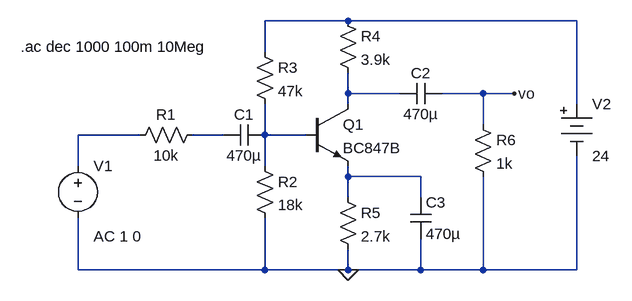
[diagram p0: schematic Actividad amplificador de frec..asc]
Actividad amplificador de frec..asc, the LTspice schematic file:
Version 4
SHEET 1 888 680
WIRE 384 -80 256 -80
WIRE 736 -80 384 -80
WIRE 256 -32 256 -80
WIRE 384 32 384 0
WIRE 464 32 384 32
WIRE 592 32 528 32
WIRE 640 32 592 32
WIRE 384 48 384 32
WIRE 736 48 736 -80
WIRE 592 80 592 32
WIRE 64 96 -32 96
WIRE 192 96 144 96
WIRE 256 96 256 48
WIRE 320 96 256 96
WIRE -32 144 -32 96
WIRE 256 144 256 96
WIRE 384 160 384 144
WIRE 496 160 384 160
WIRE 384 192 384 160
WIRE 496 192 496 160
WIRE -32 304 -32 224
WIRE 256 304 256 224
WIRE 256 304 -32 304
WIRE 384 304 384 272
WIRE 384 304 256 304
WIRE 496 304 496 256
WIRE 496 304 384 304
WIRE 592 304 592 160
WIRE 592 304 496 304
WIRE 736 304 736 128
WIRE 736 304 592 304
FLAG 384 304 0
FLAG 640 32 vo
SYMBOL voltage -32 128 R0
WINDOW 123 24 124 Left 2
WINDOW 39 0 0 Left 0
SYMATTR InstName V1
SYMATTR Value ""
SYMATTR Value2 AC 1 0
SYMBOL res 160 80 R90
WINDOW 0 0 56 VBottom 2
WINDOW 3 32 56 VTop 2
SYMATTR InstName R1
SYMATTR Value 10k
SYMBOL res 240 128 R0
SYMATTR InstName R2
SYMATTR Value 18k
SYMBOL res 240 -48 R0
SYMATTR InstName R3
SYMATTR Value 47k
SYMBOL res 368 -96 R0
SYMATTR InstName R4
SYMATTR Value 3.9k
SYMBOL res 368 176 R0
SYMATTR InstName R5
SYMATTR Value 2.7k
SYMBOL res 576 64 R0
SYMATTR InstName R6
SYMATTR Value 1k
SYMBOL cap 256 80 R90
WINDOW 0 0 32 VBottom 2
WINDOW 3 32 32 VTop 2
SYMATTR InstName C1
SYMATTR Value 470µ
SYMBOL cap 528 16 R90
WINDOW 0 0 32 VBottom 2
WINDOW 3 32 32 VTop 2
SYMATTR InstName C2
SYMATTR Value 470µ
SYMBOL cap 480 192 R0
SYMATTR InstName C3
SYMATTR Value 470µ
SYMBOL Misc\\battery 736 32 R0
WINDOW 123 0 0 Left 0
WINDOW 39 0 0 Left 0
SYMATTR InstName V2
SYMATTR Value 24
SYMBOL npn 320 48 R0
SYMATTR InstName Q1
SYMATTR Value BC847B
TEXT -120 -40 Left 2 !.ac dec 1000 100m 10Meg

The netlist it stands for:
* Actividad amplificador de frec..asc
V1 N003 0 AC 1 0
R1 N004 N003 10k
R2 N005 0 18k
R3 N001 N005 47k
R4 N001 N002 3.9k
R5 N006 0 2.7k
R6 vo 0 1k
C1 N005 N004 470µ
C2 vo N002 470µ
C3 N006 0 470µ
V2 N001 0 24
Q1 N002 N005 N006 0 BC847B
.model NPN NPN
.model PNP PNP
.lib standard.bjt
.ac dec 1000 100m 10Meg
.backanno
.end